# EAGLE schematic sphere_robo (EAGLE 8.3.0)
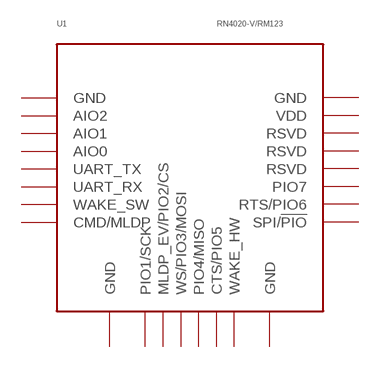
[diagram p0: schematic, sheet 1]

## Parts
U1  RN4020-V/RM123  [RN4020]
Unconnected: U1.1(GND) U1.2(AIO2) U1.3(AIO1) U1.4(AIO0) U1.5(UART_TX) U1.6(UART_RX) U1.7(WAKE_SW) U1.8(CMD/MLDP) U1.9(GND) U1.10(PIO1/SCK) U1.11(MLDP_EV/PIO2/CS) U1.12(WS/PIO3/MOSI) U1.13(PIO4/MISO) U1.14(CTS/PIO5) U1.15(WAKE_HW) U1.16(GND) U1.17(SPI/!PIO) U1.18(RTS/PIO6) U1.19(PIO7) U1.20(RSVD) U1.21(RSVD) U1.22(RSVD) U1.23(VDD) U1.24(GND)

## Library data of the parts
U1 = com_module:RN4020: Bluetooth Low Energy Module Microchip